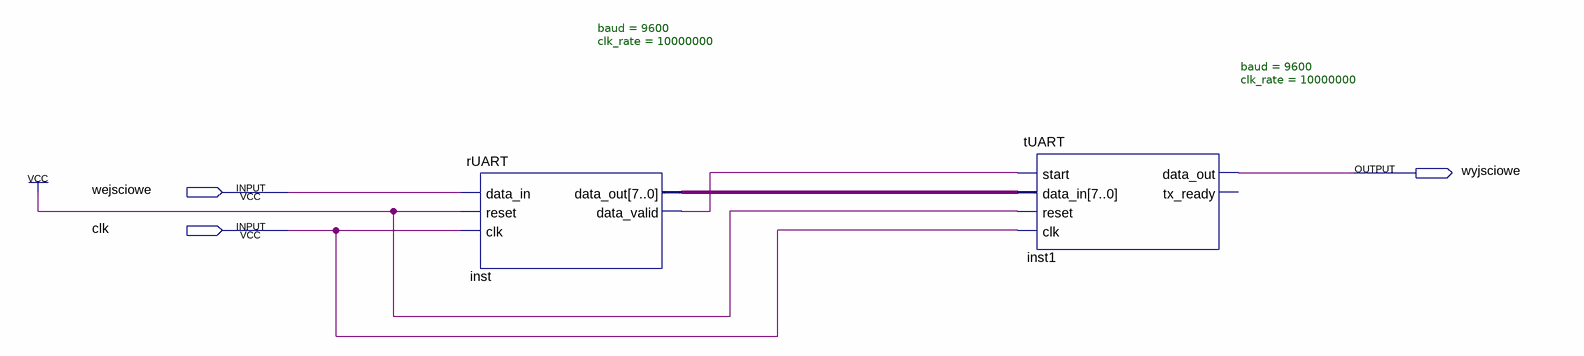
[diagram p0: schematic sheet]
// Quartus schematic UART.bdf as structural Verilog: 2 symbols, 3 pins
module UART (
  input  wejsciowe,
  input  clk,
  output wyjsciowe
);

  wire inst_data_valid;
  wire [7:0] inst_data_out;

  rUART #(.baud(9600), .clk_rate(10000000)) inst (
    .data_in(wejsciowe), .reset(1'b1), .clk(clk), .data_out(inst_data_out), .data_valid(inst_data_valid));
  tUART #(.baud(9600), .clk_rate(10000000)) inst1 (
    .start(inst_data_valid), .data_in(inst_data_out), .reset(1'b1), .clk(clk), .data_out(wyjsciowe));  // open: tx_ready
endmodule
